# EAGLE design RocMan (EAGLE 9.6.2)
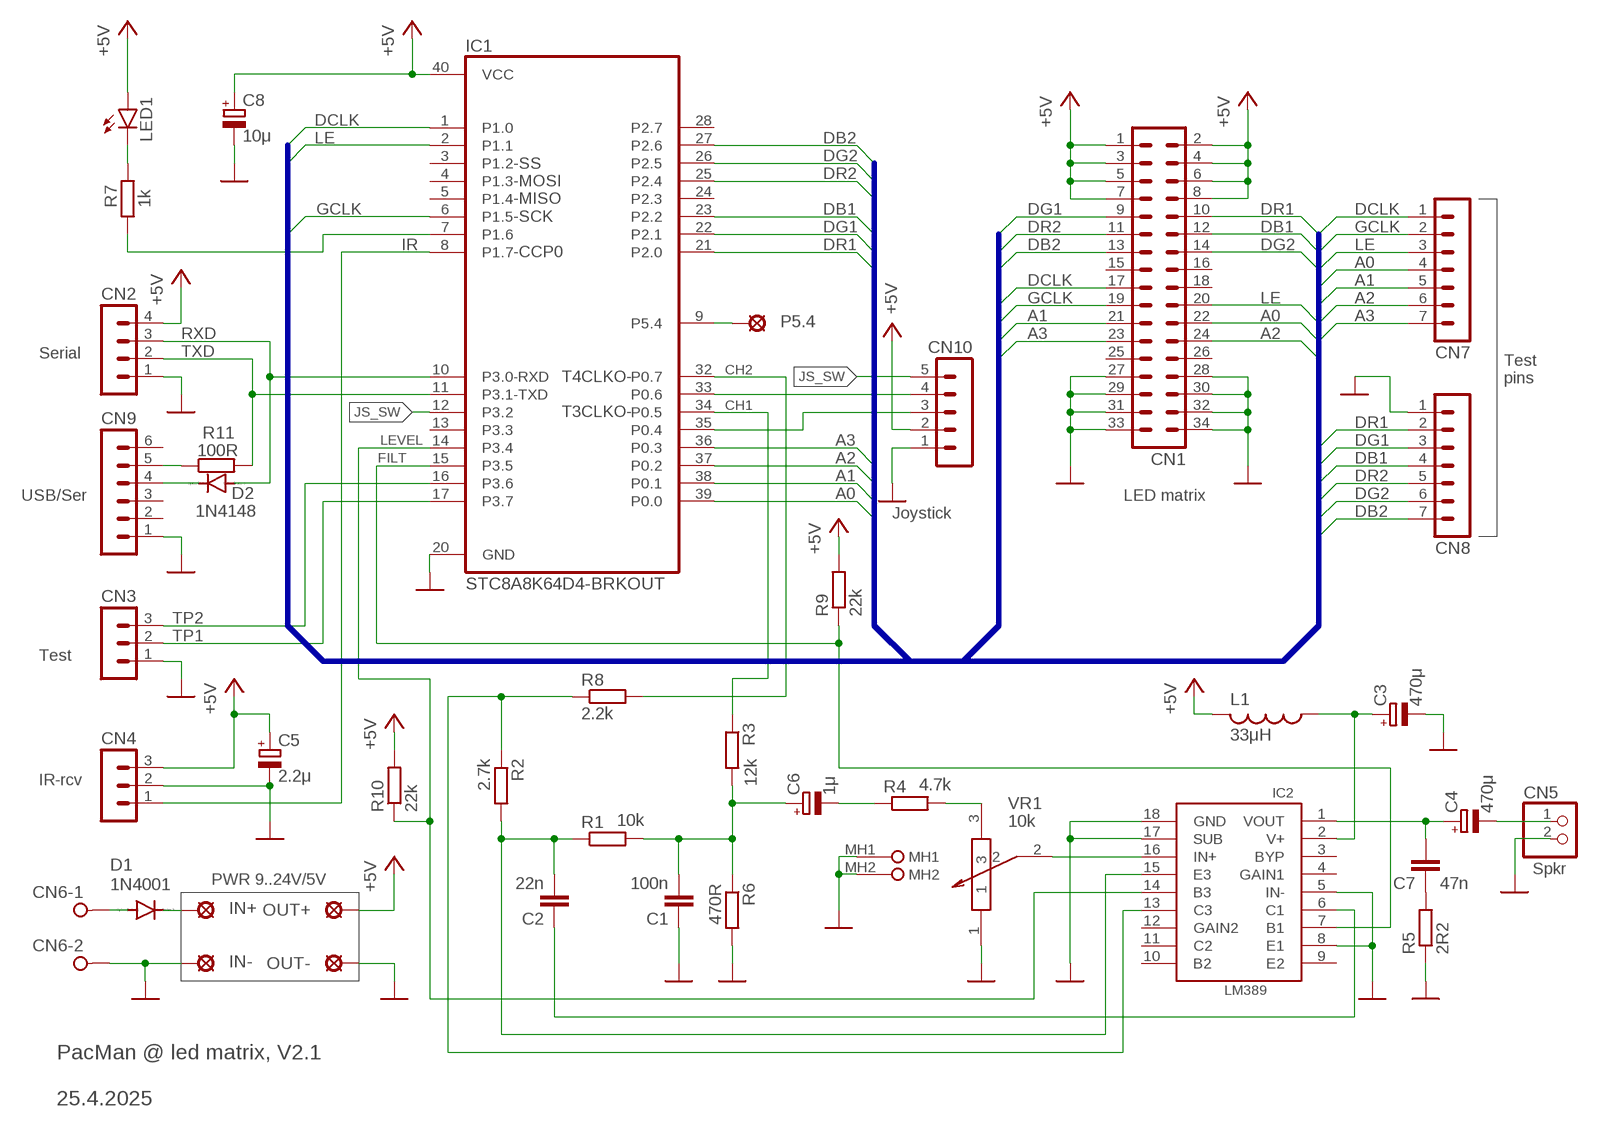
[diagram p0: schematic, sheet 1]

## Parts
C1  100n  C-EUC0805  [C0805]
C2  22n  C-EUC0805  [C0805]
C3  470μ  CPOL-EUE5-10.5  [E5-10,5]
C4  470μ  CPOL-EUE5-10.5  [E5-10,5]
C5  2.2μ  CPOL-EUSMCA  [SMC_A]
C6  1μ  CPOL-EUSMCA  [SMC_A]
C7  47n  C-EUC0805  [C0805]
C8  10μ  CPOL-EUSMCA  [SMC_A]
CN1  ML34  [ML34]
CN2  MA04-1  [MA04-1]
CN3  MA03-1  [MA03-1]
CN4  MA03-1  [MA03-1]
CN5  PINHD-1X2  [1X02]
CN6  W237-02P  [W237-132]
CN7  MA07-1  [MA07-1]
CN8  MA07-1  [MA07-1]
CN9  MA06-1  [MA06-1]
CN10  MA05-1  [MA05-1]
D1  1N4001  1N4004  [DO41-10]
D2  1N4148  DIODE-SOD123  [SOD123]
IC1  STC8A8K64D4-BRKOUT  [DIL40]
IC2  LM389  [DIL18]
IN+  LSP11  [LSP11]
IN-  LSP11  [LSP11]
L1  33μH  L-USL4532C  [L4532M]
LED1  LEDCHIP-LED0805  [CHIP-LED0805]
OUT+  LSP11  [LSP11]
OUT-  LSP11  [LSP11]
P5.4  LSP11  [LSP11]
R1  10k  R-EU_R0805  [R0805]
R2  2.7k  R-EU_R0805  [R0805]
R3  12k  R-EU_R0805  [R0805]
R4  4.7k  R-EU_R0805  [R0805]
R5  2R2  R-EU_R0805  [R0805]
R6  470R  R-EU_R0805  [R0805]
R7  1k  R-EU_R0805  [R0805]
R8  2.2k  R-EU_R0805  [R0805]
R9  22k  R-EU_R0805  [R0805]
R10  22k  R-EU_R0805  [R0805]
R11  100R  R-EU_R0805  [R0805]
VR1  10k  PTV09A-4015F-A103  [PTV09A4015FA103]

## Nets
+5V: C5.+ C8.+ CN1.1 CN1.2 CN1.3 CN1.4 CN1.5 CN1.6 CN1.7 CN1.8 CN2.4 CN4.3 CN10.2 IC1.40(VCC) L1.2 LED1.A OUT+.MP R9.2 R10.2
A0: CN1.22 CN7.4 IC1.39(P0.0)
A1: CN1.21 CN7.5 IC1.38(P0.1)
A2: CN1.24 CN7.6 IC1.37(P0.2)
A3: CN1.23 CN7.7 IC1.36(P0.3)
CH1: IC1.34(P0.5) R3.1
CH2: IC1.32(P0.7) R8.2
DB1: CN1.12 CN8.4 IC1.23(P2.2)
DB2: CN1.13 CN8.7 IC1.27(P2.6)
DCLK: CN1.17 CN7.1 IC1.1(P1.0)
DG1: CN1.9 CN8.3 IC1.22(P2.1)
DG2: CN1.14 CN8.6 IC1.26(P2.5)
DR1: CN1.10 CN8.2 IC1.21(P2.0)
DR2: CN1.11 CN8.5 IC1.25(P2.4)
FILT: IC1.15(P3.5) IC2.7(B1) R9.1
GCLK: CN1.19 CN7.2 IC1.6(P1.5)
GND: C1.1 C3.- C5.- C8.- CN1.27 CN1.28 CN1.29 CN1.30 CN1.31 CN1.32 CN1.33 CN1.34 CN2.1 CN3.1 CN4.2 CN5.2 CN6.2 CN8.1 CN9.1 CN10.1 IC1.20(GND) IC2.5(IN-) IC2.8(E1) IC2.17(SUB) IC2.18(GND) IN-.MP OUT-.MP R5.1 R6.2 VR1.1 VR1.MH1 VR1.MH2
IR: CN4.1 IC1.8(P1.7)
JS_SW: CN10.5 IC1.12(P3.2)
LE: CN1.20 CN7.3 IC1.2(P1.1)
LEVEL: IC1.14(P3.4) IC2.14(B3) R10.1
N$1: C2.2 IC2.15(E3) R1.1 R2.2
N$2: C1.2 C6.+ R1.2 R3.2 R6.1
N$3: C2.1 IC2.6(C1)
N$4: C6.- R4.1
N$5: R4.2 VR1.3
N$6: IC2.13(C3) R2.1 R8.1
N$7: IC2.16(IN+) VR1.2
N$8: C3.+ IC2.2(V+) L1.1
N$9: CN6.1 D1.A
N$10: C4.+ C7.2 IC2.1(VOUT)
N$11: C4.- CN5.1
N$12: D1.C IN+.MP
N$13: C7.1 R5.2
N$14: IC1.7(P1.6) R7.1
N$15: LED1.C R7.2
N$16: CN9.5 R11.1
N$17: CN9.4 D2.C
N$18: CN10.4 IC1.33(P0.6)
N$19: CN10.3 IC1.35(P0.4)
N$22: IC1.9(P5.4) P5.4.MP
RXD: CN2.3 D2.A IC1.10(P3.0-RXD)
TP1: CN3.2 IC1.17(P3.7)
TP2: CN3.3 IC1.16(P3.6)
TXD: CN2.2 IC1.11(P3.1-TXD) R11.2
Unconnected: CN1.15 CN1.16 CN1.18 CN1.25 CN1.26 CN9.2 CN9.3 CN9.6 IC1.3(P1.2) IC1.4(P1.3) IC1.5(P1.4) IC1.13(P3.3) IC1.24(P2.3) IC1.28(P2.7) IC2.3(BYP) IC2.4(GAIN1) IC2.9(E2) IC2.10(B2) IC2.11(C2) IC2.12(GAIN2)

## Buses
A0,A1,A2,A3,DB1,DB2,DCLK,DG1,DG2,DR1,DR2,GCLK,LE

## Notes on the sheet
- -SS
  -MOSI
  -MISO
  -SCK
- -CCP0
- Serial
- Test
  pins
- T4CLKO-
  
  T3CLKO-
- USB/Ser | LED matrix
- Joystick
- Test
- IR-rcv
- Spkr
- PWR 9..24V/5V
- PacMan @ led matrix, V2.1
  
  25.4.2025

## Library data of the parts
C1 C2 C7 = rcl:C-EU: CAPACITOR, European symbol; SPICEPREFIX: C
C3-C6 C8 = rcl:CPOL-EU: POLARIZED CAPACITOR, European symbol; SPICEPREFIX: C
CN1 = con-harting-ml:ML34: HARTING; OC_FARNELL: unknown; OC_NEWARK: unknown
CN2 = con-lstb:MA04-1: PIN HEADER; OC_FARNELL: unknown; OC_NEWARK: unknown
CN3 CN4 = con-lstb:MA03-1: PIN HEADER; OC_FARNELL: unknown; OC_NEWARK: unknown
CN5 = pinhead:PINHD-1X2: PIN HEADER
CN6 = con-wago-508:W237-02P: WAGO SREW CLAMP; OC_FARNELL: unknown; OC_NEWARK: unknown
CN7 CN8 = con-lstb:MA07-1: PIN HEADER; OC_FARNELL: unknown; OC_NEWARK: unknown
CN9 = con-lstb:MA06-1: PIN HEADER; OC_FARNELL: unknown; OC_NEWARK: unknown
CN10 = con-lstb:MA05-1: PIN HEADER; OC_FARNELL: unknown; OC_NEWARK: unknown
D1 = diode:1N4004: DIODE general purpose rectifier, 1 A
D2 = diode:DIODE-: DIODE
IC1 = stc-omat:STC8A8K64D4-BRKOUT: STC8A8K64D4/QFP48 @ DIP-40 breakout from eBay
IC2 = omat-muut:LM389
IN+ IN- OUT+ OUT- P5.4 = solpad:LSP11: SOLDER PAD drill 1.1 mm
L1 = rcl:L-US: INDUCTOR, American symbol; SPICEPREFIX: L
LED1 = led:LED: LED OSRAM: - CHIPLED LG R971, LG N971, LY N971, LG Q971, LY Q971, LO R971, LY R971 LH N974, LH R974 LS Q976, LO Q976, LY Q976 LO Q996 - Hyper CHIPLED LW Q18S LB Q993, LB Q99A, LB R99A - SideLED LS A670, LO A670, LY A670, LG A670, LP A670 LB A673, LV A673, LT A673, LW A673 LH A674 LY A675 LS A676, LA A676, LO A676, LY A676, LW A676 LS A679, LY A679, LG A679 - Hyper Micro SIDELED® LS Y876, LA Y876, LO Y876, LY Y876 LT Y87S - SmartLED LW L88C, LW L88S LB L89C, LB L89S, LG L890 LS L89K, LO L89K, LY L89K LS L896, LA L896, LO L896, LY L896 - TOPLED LS T670, LO T670, LY T670, LG T670, LP T670 LSG T670, LSP T670, LSY T670, LOP T670, LYG T670 LG T671, LOG T671, LSG T671 LB T673, LV T673, LT T673, LW T673 LH T674 LS T676, LA T676, LO T676, LY T676, LB T676, LH T676, LSB T676, LW T676 LB T67C, LV T67C, LT T67C, LS T67K, LO T67K, LY T67K, LW E67C LS E67B, LA E67B, LO E67B, LY E67B, LB E67C, LV E67C, LT E67C LW T67C LS T679, LY T679, LG T679 LS T770, LO T770, LY T770, LG T770, LP T770 LB T773, LV T773, LT T773, LW T773 LH T774 LS E675, LA E675, LY E675, LS T675 LS T776, LA T776, LO T776, LY T776, LB T776 LHGB T686 LT T68C, LB T68C - Hyper Mini TOPLED® LB M676 - Mini TOPLED Santana® LG M470 LS M47K, LO M47K, LY M47K Source: http://www.osram.convergy.de LUXEON: - LUMILED® LXK2-PW12-R00, LXK2-PW12-S00, LXK2-PW14-U00, LXK2-PW14-V00 LXK2-PM12-R00, LXK2-PM12-S00, LXK2-PM14-U00 LXK2-PE12-Q00, LXK2-PE12-R00, LXK2-PE12-S00, LXK2-PE14-T00, LXK2-PE14-U00 LXK2-PB12-K00, LXK2-PB12-L00, LXK2-PB12-M00, LXK2-PB14-N00, LXK2-PB14-P00, LXK2-PB14-Q00 LXK2-PR12-L00, LXK2-PR12-M00, LXK2-PR14-Q00, LXK2-PR14-R00 LXK2-PD12-Q00, LXK2-PD12-R00, LXK2-PD12-S00 LXK2-PH12-R00, LXK2-PH12-S00 LXK2-PL12-P00, LXK2-PL12-Q00, LXK2-PL12-R00 Source: www.luxeon.com KINGBRIGHT: KA-3528ASYC Source: www.kingbright.com
R1-R11 = rcl:R-EU_: RESISTOR, European symbol; SPICEPREFIX: R
VR1 = omat-muut:PTV09A-4015F-A103: Potentiometers 10K AUDIO 20% Source: Datasheet <https://www.bourns.com/docs/Product-Datasheets/PTV09.pdf>; DESCRIPTION: Potentiometers 10K AUDIO 20%; HEIGHT: 15.5mm; MANUFACTURER_NAME: Bourns; MANUFACTURER_PART_NUMBER: PTV09A-4015F-A103; MOUSER_PART_NUMBER: 652-PTV09A-4015FA103; MOUSER_PRICE-STOCK: https://www.mouser.co.uk/ProductDetail/Bourns/PTV09A-4015F-A103?qs=Qzws7J6gxqwyx8aBn%2Flmmw%3D%3D

## Board
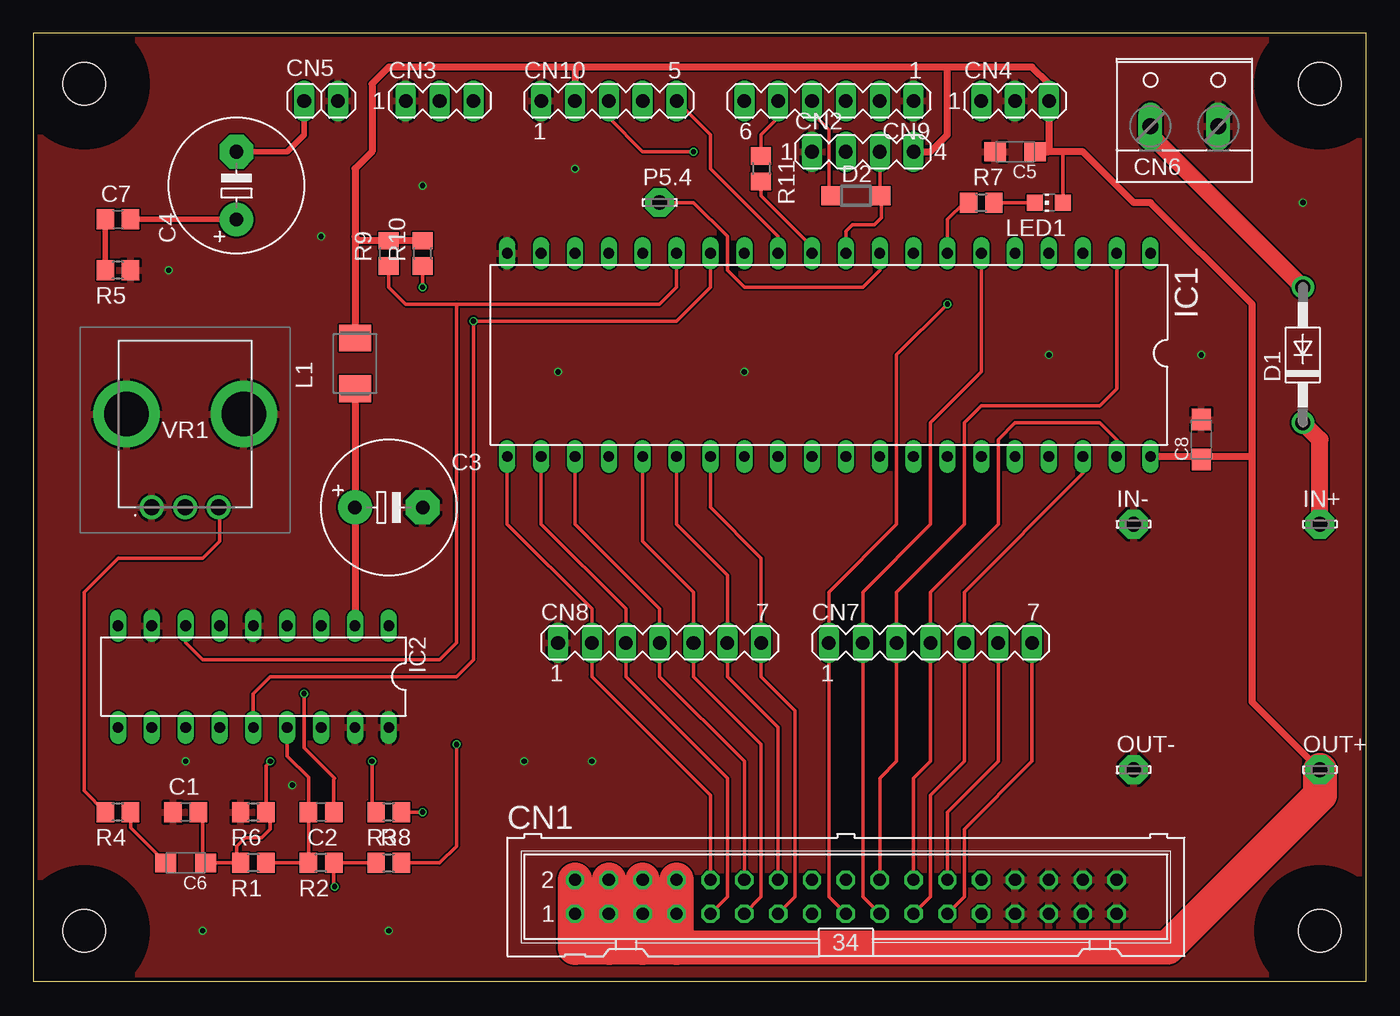
[diagram p1: board, top side]
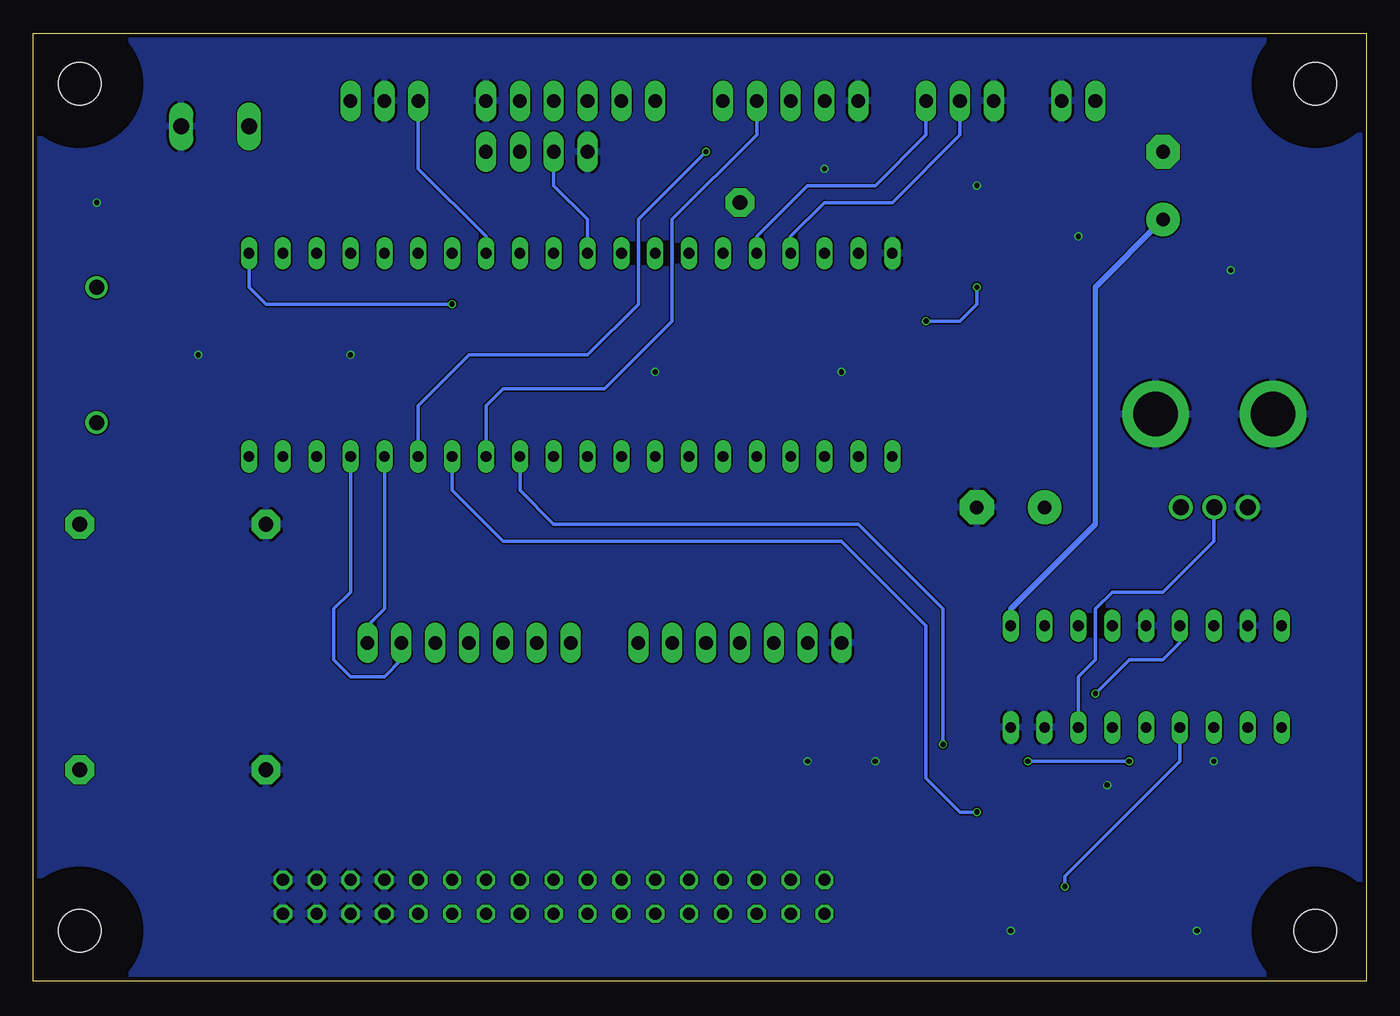
[diagram p2: board, bottom side, seen from below]

Size 100 x 71.11 mm. Coordinates in mm from the lower left corner, seen from the top.
Outline: 0,0 100,0 100,71.11 0,71.11 0,0
Copper layers (1*16): Top 0.035mm / dielectric 1.5mm / Bottom 0.035mm
Design rules "PCBWay_2L_100um-Track": minimum track width 0.1mm, minimum drill 0.3mm, track to track 0.1mm, track to pad 0.1mm, pad to pad 0.1mm, via to via 0.1mm, smd to smd 0mil, copper to edge 0.3mm, drill to drill 10mil, minimum pad ring 6mil, minimum via ring 0.1mm, stop-mask expansion 2mil, vias tented up to drill 0.45mm, thermal gap 0.2mm
Holes 3.2 mm at 3.81,67.31 3.81,3.81 96.52,3.81 96.52,67.31
tRestrict: area -0.8,-0.8 to 8.4,8.4; area 91.9,-0.8 to 101.1,8.4; area 91.9,62.7 to 101.1,71.9; area -0.8,62.7 to 8.4,71.9
bRestrict: area -0.8,-0.8 to 8.4,8.4; area 91.9,-0.8 to 101.1,8.4; area -0.8,62.7 to 8.4,71.9; area 91.9,62.7 to 101.1,71.9

### Footprints (pad centres in the part's own frame; a part is rotated, then mirrored left to right if it is on the bottom)
C0805 = smd 1.3 x 1.5: 1 -0.95,0; 2 0.95,0
E5-10,5 = drill 1.016 pad 2.54: + -2.54,0 | drill 1.016 pad 2.54 octagon: - 2.54,0
SMC_A = smd 1.6 x 1.4: + -1.5,0; - 1.5,0
ML34 = drill 0.914 octagon: 1 -20.32,-1.27; 2 -20.32,1.27; 3 -17.78,-1.27; 4 -17.78,1.27; 5 -15.24,-1.27; 6 -15.24,1.27; 7 -12.7,-1.27; 8 -12.7,1.27; 9 -10.16,-1.27; 10 -10.16,1.27; 11 -7.62,-1.27; 12 -7.62,1.27; 13 -5.08,-1.27; 14 -5.08,1.27; 15 -2.54,-1.27; 16 -2.54,1.27; 17 0,-1.27; 18 0,1.27; 19 2.54,-1.27; 20 2.54,1.27; 21 5.08,-1.27; 22 5.08,1.27; 23 7.62,-1.27; 24 7.62,1.27; 25 10.16,-1.27; 26 10.16,1.27; 27 12.7,-1.27; 28 12.7,1.27; 29 15.24,-1.27; 30 15.24,1.27; 31 17.78,-1.27; 32 17.78,1.27; 33 20.32,-1.27; 34 20.32,1.27
MA04-1 = drill 1.016 long: 1 -3.81,0; 2 -1.27,0; 3 1.27,0; 4 3.81,0
MA03-1 = drill 1.016 long: 1 -2.54,0; 2 0,0; 3 2.54,0
1X02 = drill 1.016 long: 1 -1.27,0; 2 1.27,0
W237-132 = drill 1.194 long: 1 -2.54,-0.635; 2 2.54,-0.635
MA07-1 = drill 1.016 long: 1 -7.62,0; 2 -5.08,0; 3 -2.54,0; 4 0,0; 5 2.54,0; 6 5.08,0; 7 7.62,0
MA06-1 = drill 1.016 long: 1 -6.35,0; 2 -3.81,0; 3 -1.27,0; 4 1.27,0; 5 3.81,0; 6 6.35,0
MA05-1 = drill 1.016 long: 1 -5.08,0; 2 -2.54,0; 3 0,0; 4 2.54,0; 5 5.08,0
DO41-10 = drill 1.118: A 5.08,0; C -5.08,0
SOD123 = smd 1.4 x 1.4: A 1.9,0; C -1.9,0
DIL40 = drill 0.813 long: 1 -24.13,-7.62; 2 -21.59,-7.62; 3 -19.05,-7.62; 4 -16.51,-7.62; 5 -13.97,-7.62; 6 -11.43,-7.62; 7 -8.89,-7.62; 8 -6.35,-7.62; 9 -3.81,-7.62; 10 -1.27,-7.62; 11 1.27,-7.62; 12 3.81,-7.62; 13 6.35,-7.62; 14 8.89,-7.62; 15 11.43,-7.62; 16 13.97,-7.62; 17 16.51,-7.62; 18 19.05,-7.62; 19 21.59,-7.62; 20 24.13,-7.62; 21 24.13,7.62; 22 21.59,7.62; 23 19.05,7.62; 24 16.51,7.62; 25 13.97,7.62; 26 11.43,7.62; 27 8.89,7.62; 28 6.35,7.62; 29 3.81,7.62; 30 1.27,7.62; 31 -1.27,7.62; 32 -3.81,7.62; 33 -6.35,7.62; 34 -8.89,7.62; 35 -11.43,7.62; 36 -13.97,7.62; 37 -16.51,7.62; 38 -19.05,7.62; 39 -21.59,7.62; 40 -24.13,7.62
DIL18 = drill 0.813 long: 1 -10.16,-3.81; 2 -7.62,-3.81; 3 -5.08,-3.81; 4 -2.54,-3.81; 5 0,-3.81; 6 2.54,-3.81; 7 5.08,-3.81; 8 7.62,-3.81; 9 10.16,-3.81; 10 10.16,3.81; 11 7.62,3.81; 12 5.08,3.81; 13 2.54,3.81; 14 0,3.81; 15 -2.54,3.81; 16 -5.08,3.81; 17 -7.62,3.81; 18 -10.16,3.81
LSP11 = drill 1.118 pad 2.159 octagon: MP 0,0
L4532M = smd 2 x 2.4: 1 -1.9,0; 2 1.9,0
CHIP-LED0805 = smd 1.2 x 1.2: A 0,-1.05; C 0,1.05
R0805 = smd 1.3 x 1.5: 1 -0.95,0; 2 0.95,0
PTV09A4015FA103 = drill 1.2 pad 1.8: 1 0,0; 2 2.5,0; 3 5,0 | drill 3.32 pad 4.98: MH1 -1.9,7; MH2 6.9,7

### Placement (x,y rotation side)
C1  11.43,12.7 0 top
C2  21.59,12.7 180 top
C3  26.67,35.56 0 top
C4  15.24,59.69 90 top
C5  73.66,62.23 180 top
C6  11.43,8.89 180 top
C7  6.35,57.15 0 top
C8  87.63,40.64 90 top
CN1  60.96,6.35 0 top
CN2  62.23,62.23 0 top
CN3  30.48,66.04 0 top
CN4  73.66,66.04 0 top
CN5  21.59,66.04 0 top
CN6  86.36,64.77 0 top
CN7  67.31,25.4 0 top
CN8  46.99,25.4 0 top
CN9  59.69,66.04 180 top
CN10  43.18,66.04 0 top
D1  95.25,46.99 90 top
D2  61.72,58.93 0 top
IC1  59.69,46.99 180 top
IC2  16.51,22.86 180 top
IN+  96.52,34.29 0 top
IN-  82.55,34.29 0 top
L1  24.13,46.36 90 top
LED1  76.2,58.42 90 top
OUT+  96.52,15.88 0 top
OUT-  82.55,15.88 0 top
P5.4  46.99,58.42 0 top
R1  16.51,8.89 180 top
R2  21.59,8.89 180 top
R3  26.67,12.7 180 top
R4  6.35,12.7 180 top
R5  6.35,53.34 180 top
R6  16.51,12.7 180 top
R7  71.12,58.42 0 top
R8  26.67,8.89 0 top
R9  26.67,54.61 90 top
R10  29.21,54.61 90 top
R11  54.61,60.96 270 top
VR1  8.89,35.56 0 top

### Tracks (layer width: path | path; a pad name or v marks a point on that pad's centre or on a via)
+5V
  Top 0.254: LED1.A 77.25,62.01 77.47,62.23
  Top 0.508: OUT+.MP 91.44,20.95 91.44,39.37 | 91.44,39.37 87.86,39.37 C8.+ 87.4,39.37 IC1.40 | 91.44,39.37 91.44,50.8 83.82,58.42 82.55,58.42 78.74,62.23 77.47,62.23 C5.+ 76.2,62.23 CN4.3 76.2,67.31 74.93,68.58 68.58,68.58 | CN1.8 CN1.7 CN1.5 CN1.3 CN1.1 | 68.58,68.58 40.64,68.58 | 40.64,68.58 CN10.2 | 40.64,68.58 26.67,68.58 25.4,67.31 25.4,62.23 24.13,60.96 24.13,55.88 | 24.13,55.88 L1.2 | R10.2 R9.2 24.45,55.56 24.13,55.88 | CN2.4 67.31,62.23 68.58,63.5 68.58,68.58
  Top 2.54: OUT+.MP 96.52,13.97 85.09,2.54 48.26,2.54 45.72,2.54 43.18,2.54 40.64,2.54
  Top 2.6: 40.64,2.54 CN1.1 CN1.2 | CN1.4 CN1.3 43.18,2.54 | CN1.6 CN1.5 45.72,2.54 | CN1.8 48.26,2.54
A0
  Top 0.254: IC1.39 81.28,40.64 80.01,41.91 73.66,41.91 72.39,40.64 72.39,34.29 67.31,29.21 CN7.4 67.31,16.51 66.04,15.24 CN1.22
A1
  Top 0.254: IC1.38 78.74,38.1 69.85,29.21 CN7.5 69.85,16.51 67.31,13.97 67.31,6.35 CN1.21
A2
  Top 0.254: CN7.6 72.39,16.51 68.58,12.7 CN1.24
  Bottom 0.254: IC1.37 76.2,29.21 77.47,27.94 77.47,24.13 76.2,22.86 73.66,22.86 72.39,24.13 CN7.6
A3
  Top 0.254: CN7.7 74.93,16.51 69.85,11.43 69.85,6.35 CN1.23
  Bottom 0.254: IC1.36 73.66,27.94 74.93,26.67 CN7.7
CH1  (via drill 0.4)
  Top 0.254: v29.21,12.7 R3.1
  Bottom 0.254: IC1.34 68.58,36.83 64.77,33.02 39.37,33.02 33.02,26.67 33.02,15.24 30.48,12.7 v29.21,12.7
CH2  (via drill 0.4)
  Top 0.254: v31.75,17.78 31.75,10.16 30.48,8.89 R8.2
  Bottom 0.254: IC1.32 63.5,36.83 60.96,34.29 38.1,34.29 31.75,27.94 v31.75,17.78
DB1
  Top 0.254: IC1.23 40.64,34.29 46.99,27.94 CN8.4 46.99,22.86 53.34,16.51 CN1.12
DB2
  Top 0.254: IC1.27 50.8,35.56 54.61,31.75 CN8.7 54.61,22.86 57.15,20.32 57.15,6.35 CN1.13
DCLK  (via drill 0.4)
  Top 0.254: v68.58,50.8 64.77,46.99 64.77,34.29 59.69,29.21 CN7.1 59.69,6.35 CN1.17
  Bottom 0.254: IC1.1 83.82,52.07 82.55,50.8 v68.58,50.8
DG1
  Top 0.254: IC1.22 38.1,34.29 44.45,27.94 CN8.3 44.45,22.86 52.07,15.24 52.07,6.35 CN1.9
DG2
  Top 0.254: IC1.26 48.26,34.29 52.07,30.48 CN8.6 52.07,22.86 55.88,19.05 CN1.14
DR1
  Top 0.254: IC1.21 35.56,34.29 41.91,27.94 CN8.2 41.91,22.86 50.8,13.97 CN1.10
DR2
  Top 0.254: IC1.25 45.72,33.02 49.53,29.21 CN8.5 49.53,22.86 54.61,17.78 54.61,6.35 CN1.11
FILT
  Top 0.254: IC2.7 11.43,25.4 12.7,24.13 30.48,24.13 31.75,25.4 31.75,50.8 | 31.75,50.8 46.99,50.8 48.26,52.07 IC1.15 | R9.1 26.67,52.07 27.94,50.8 31.75,50.8
GCLK
  Top 0.254: IC1.6 71.12,45.72 67.31,41.91 67.31,34.29 62.23,29.21 CN7.2 62.23,6.35 CN1.19
GND  (via drill 0.4)
  other vias: 36.83,16.51 41.91,16.51 26.67,3.81 12.7,3.81 10.16,53.34 87.63,46.99 95.25,58.42 19.43,14.73 29.21,59.69 39.37,45.72 53.34,45.72 76.2,46.99 40.64,60.96 21.59,55.88 11.43,16.51
  pour Bottom: -1.27,72.39 101.6,72.39 101.6,-1.27 -1.27,-1.27
  pour Top (isolate 0.127): -1.27,72.39 101.6,72.39 101.6,-1.27 -1.27,-1.27
IR
  Bottom 0.254: CN4.1 71.12,60.96 66.04,55.88 IC1.8
JS_SW
  Top 0.254: IC1.12 55.88,55.88 50.8,60.96 50.8,63.5 CN10.5
LE
  Top 0.254: IC1.2 81.28,44.45 80.01,43.18 71.12,43.18 69.85,41.91 69.85,34.29 64.77,29.21 CN7.3 64.77,16.51 63.5,15.24 CN1.20
LEVEL  (via drill 0.4)
  Top 0.254: IC2.14 16.51,21.59 17.78,22.86 31.75,22.86 33.02,24.13 v33.02,49.53 48.26,49.53 50.8,52.07 IC1.14 | v29.21,52.07 R10.1
  Bottom 0.254: v33.02,49.53 30.48,49.53 29.21,50.8 v29.21,52.07
N$1
  Top 0.254: IC2.15 19.05,16.89 20.64,15.3 C2.2 R2.2 R1.1
N$2  (via drill 0.4)
  Top 0.254: R3.2 25.4,13.02 v25.4,16.51 | v17.78,16.51 17.46,16.19 R6.1 17.78,12.38 17.78,11.43 17.14,10.79 15.88,10.79 15.24,10.16 15.24,9.21 R1.2 C6.+ 12.7,9.12 12.7,12.38 C1.2
  Bottom 0.254: v25.4,16.51 v17.78,16.51
N$3  (via drill 0.4)
  Top 0.254: C2.1 22.54,15.17 22.61,15.24 20.32,17.53 v20.32,21.59
  Bottom 0.254: v20.32,21.59 17.78,24.13 15.24,24.13 13.97,25.4 IC2.6
N$4
  Top 0.254: C6.- 7.3,11.52 R4.1
N$5
  Top 0.254: R4.2 3.81,14.29 3.81,29.21 6.35,31.75 12.7,31.75 13.97,33.02 13.97,35.48 VR1.3
N$6  (via drill 0.4)
  Top 0.254: v22.61,7.11 22.54,7.18 R2.1 R8.1
  Bottom 0.254: v22.61,7.11 22.61,7.87 13.97,16.51 IC2.13
N$7
  Bottom 0.254: VR1.2 11.43,35.52 11.43,33.02 15.24,29.21 19.05,29.21 20.32,27.94 20.32,24.13 21.59,22.86 IC2.16
N$8
  Top 0.508: L1.1 C3.+ IC2.2
N$9
  Top 1.27: D1.A 83.82,63.5 CN6.1
N$10
  Top 0.406: C7.2 C4.+
  Bottom 0.406: IC2.1 26.67,27.94 20.32,34.29 20.32,52.07 C4.+
N$11
  Top 0.406: CN5.1 20.32,63.5 19.05,62.23 C4.-
N$12
  Top 1.27: IN+.MP 96.52,40.64 D1.C
N$13
  Top 0.406: C7.1 R5.2
N$14
  Top 0.254: IC1.7 68.58,57.15 69.85,58.42 R7.1
N$15
  Top 0.254: LED1.C R7.2
N$16
  Top 0.254: R11.1 54.61,63.5 55.88,64.77 CN9.5
N$17
  Top 0.254: D2.C 59.7,59.05 59.7,63.88 58.42,65.15 CN9.4
N$18
  Bottom 0.254: IC1.33 66.04,43.18 64.77,44.45 57.15,44.45 52.07,49.53 52.07,57.15 45.72,63.5 CN10.4
N$19  (via drill 0.4)
  Top 0.254: v49.53,62.23 45.72,62.23 43.18,64.77 CN10.3
  Bottom 0.254: IC1.35 71.12,43.18 67.31,46.99 58.42,46.99 54.61,50.8 54.61,57.15 v49.53,62.23
N$22
  Top 0.254: IC1.9 63.5,53.34 62.23,52.07 53.34,52.07 52.07,53.34 52.07,55.88 49.53,58.42 P5.4.MP
RXD
  Top 0.254: IC1.10 60.96,56.26 61.47,56.77 63.12,56.77 63.62,57.27 D2.A 63.5,59.05 CN2.3
TP1
  Bottom 0.254: IC1.17 43.18,55.88 40.64,58.42 35.56,58.42 30.48,63.5 CN3.2
TP2
  Bottom 0.254: IC1.16 45.72,55.88 41.91,59.69 36.83,59.69 33.02,63.5 CN3.3
TXD
  Top 0.254: IC1.11 58.42,55.12 54.61,58.93 R11.2
  Bottom 0.254: IC1.11 58.42,57.15 60.96,59.69 CN2.2

### Text on the board
tValues: SPKR | + | - | GND | TP1 | TP2 | GND | +5V | X | Y | SW | RX | TX | IR | GND | +5V | GND | P5.4 | + | GND | LED | 9...24V | + | + | + | GND | DB2 | DCLK | GCLK | A3 | IN- | IN+ | DR1 | DG1 | DB1 | DR2 | DG2 | LE | A0 | A1 | A2 | LM389 | OUT- | OUT+ | Rocman V2.1 / / 280425